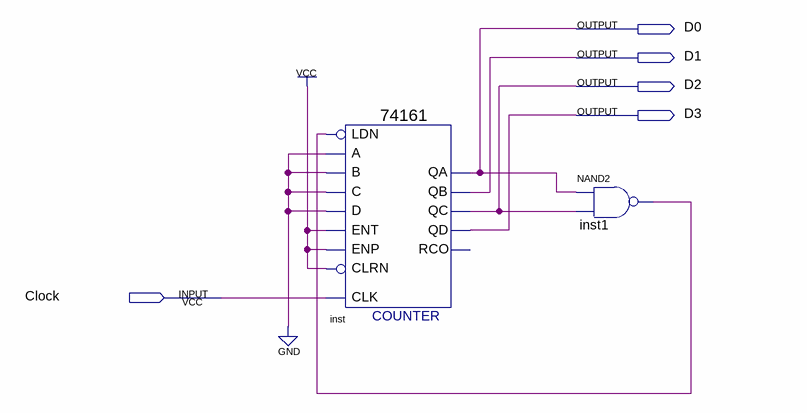
[diagram p0: schematic sheet]
// Quartus schematic mod6.bdf as structural Verilog: 2 symbols, 5 pins
module mod6 (
  input  Clock,
  output D0,
  output D1,
  output D2,
  output D3
);

  wire inst1_out;

  \74161  inst (
    .CLRN(1'b1), .CLK(Clock), .ENP(1'b1), .LDN(inst1_out), .A(1'b0), .D(1'b0), .ENT(1'b1), .B(1'b0),
    .C(1'b0), .QD(D3), .QC(D2), .QB(D1), .QA(D0));  // open: RCO
  nand inst1 (inst1_out, D0, D2);
endmodule
